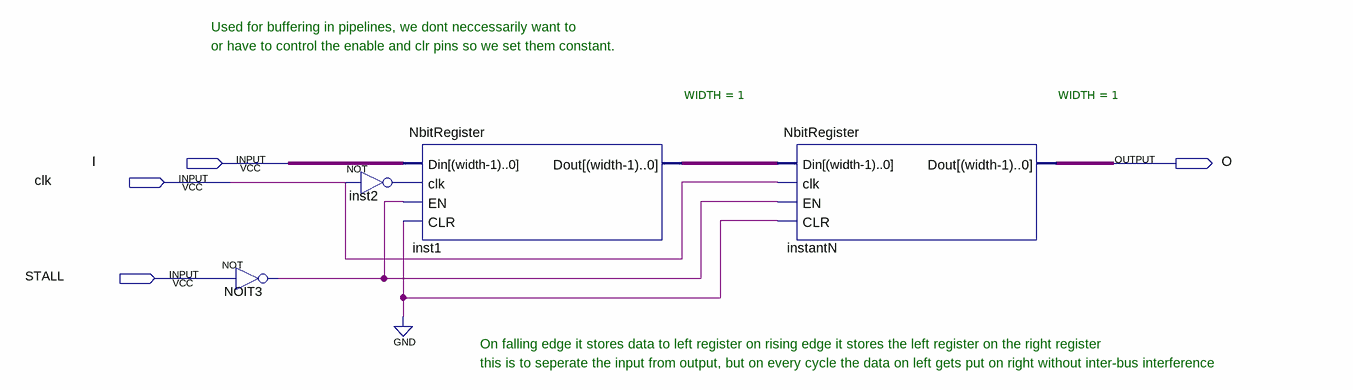
[diagram p0: schematic sheet]
// Quartus schematic 1bitBR.bdf as structural Verilog: 4 symbols, 4 pins
module \1bitBR  (
  input  I,
  input  clk,
  input  STALL,
  output O
);

  wire inst1_dout, inst2_out, NOIT3_out;

  not NOIT3 (NOIT3_out, STALL);
  not inst2 (inst2_out, clk);
  NbitRegister #(.WIDTH(1)) inst1 (.Din(I), .clk(inst2_out), .EN(NOIT3_out), .CLR(1'b0), .Dout(inst1_dout));
  NbitRegister #(.WIDTH(1)) instantN (.Din(inst1_dout), .clk(clk), .EN(NOIT3_out), .CLR(1'b0), .Dout(O));

  // Notes on the sheet:
  //   Used for buffering in pipelines, we dont neccessarily want to
  //   or have to control the enable and clr pins so we set them constant.
  //   On falling edge it stores data to left register on rising edge it stores the left register on the right register
  //   this is to seperate the input from output, but on every cycle the data on left gets put on right without inter-bus interference
endmodule
